# Altium schematic sheet backplane.SchDoc
size A
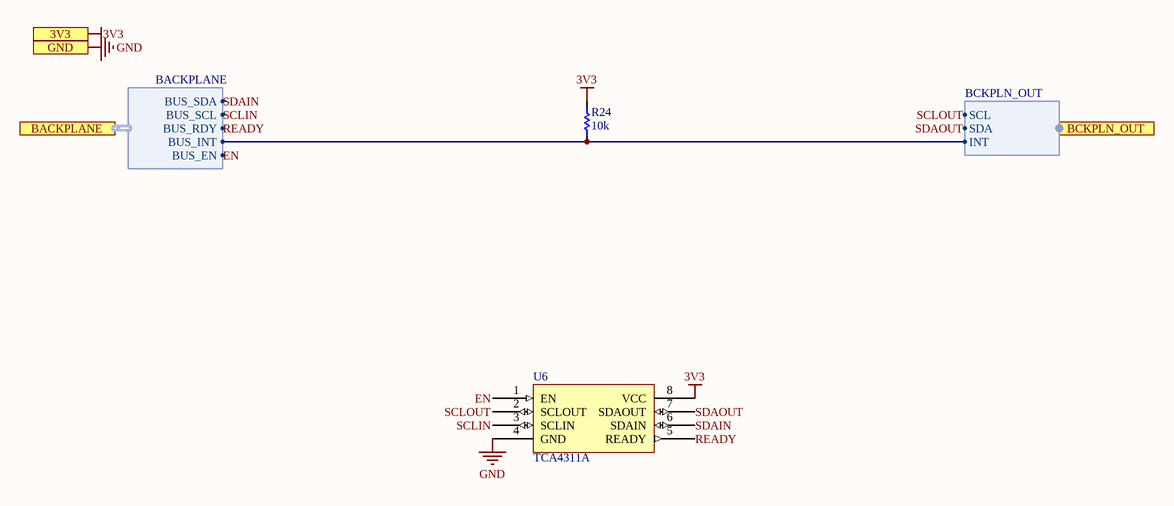
[diagram p0: backplane.SchDoc]

## Parts
R24  10k  [RES 0603 L]
U6  TCA4311A  [SSOP-8]

## Ports
3V3, BACKPLANE (harness BACKPLANE), BCKPLN_OUT (harness BCKPLN_OUT), GND

## Harnesses
BACKPLANE: BUS_EN, BUS_INT, BUS_RDY, BUS_SCL, BUS_SDA
BCKPLN_OUT: SCL, SDA, INT

## Nets
3V3: R24.2 U6.8(VCC) ; port 3V3
GND: U6.4(GND) ; port GND
EN: U6.1(EN) ; port BACKPLANE.BUS_EN
READY: U6.5(READY) ; port BACKPLANE.BUS_RDY
SCLIN: U6.3(SCLIN) ; port BACKPLANE.BUS_SCL
SCLOUT: U6.2(SCLOUT) ; port BCKPLN_OUT.SCL
SDAIN: U6.6(SDAIN) ; port BACKPLANE.BUS_SDA
SDAOUT: U6.7(SDAOUT) ; port BCKPLN_OUT.SDA
NetR24_1: R24.1 ; port BACKPLANE.BUS_INT, port BCKPLN_OUT.INT

## Library data of the parts
R24 = RES 0603
U6 = IC I2C HOTSWAP BUF: Supplier 1: Digi-Key; Supplier Part Number 1: 296-28328-1-ND